# Altium schematic sheet Block_Diagram.SchDoc
size 420 x 297 mm; Date: 10.07.2023; Revision: AA; SheetNumber: 1; SheetTotal: 4
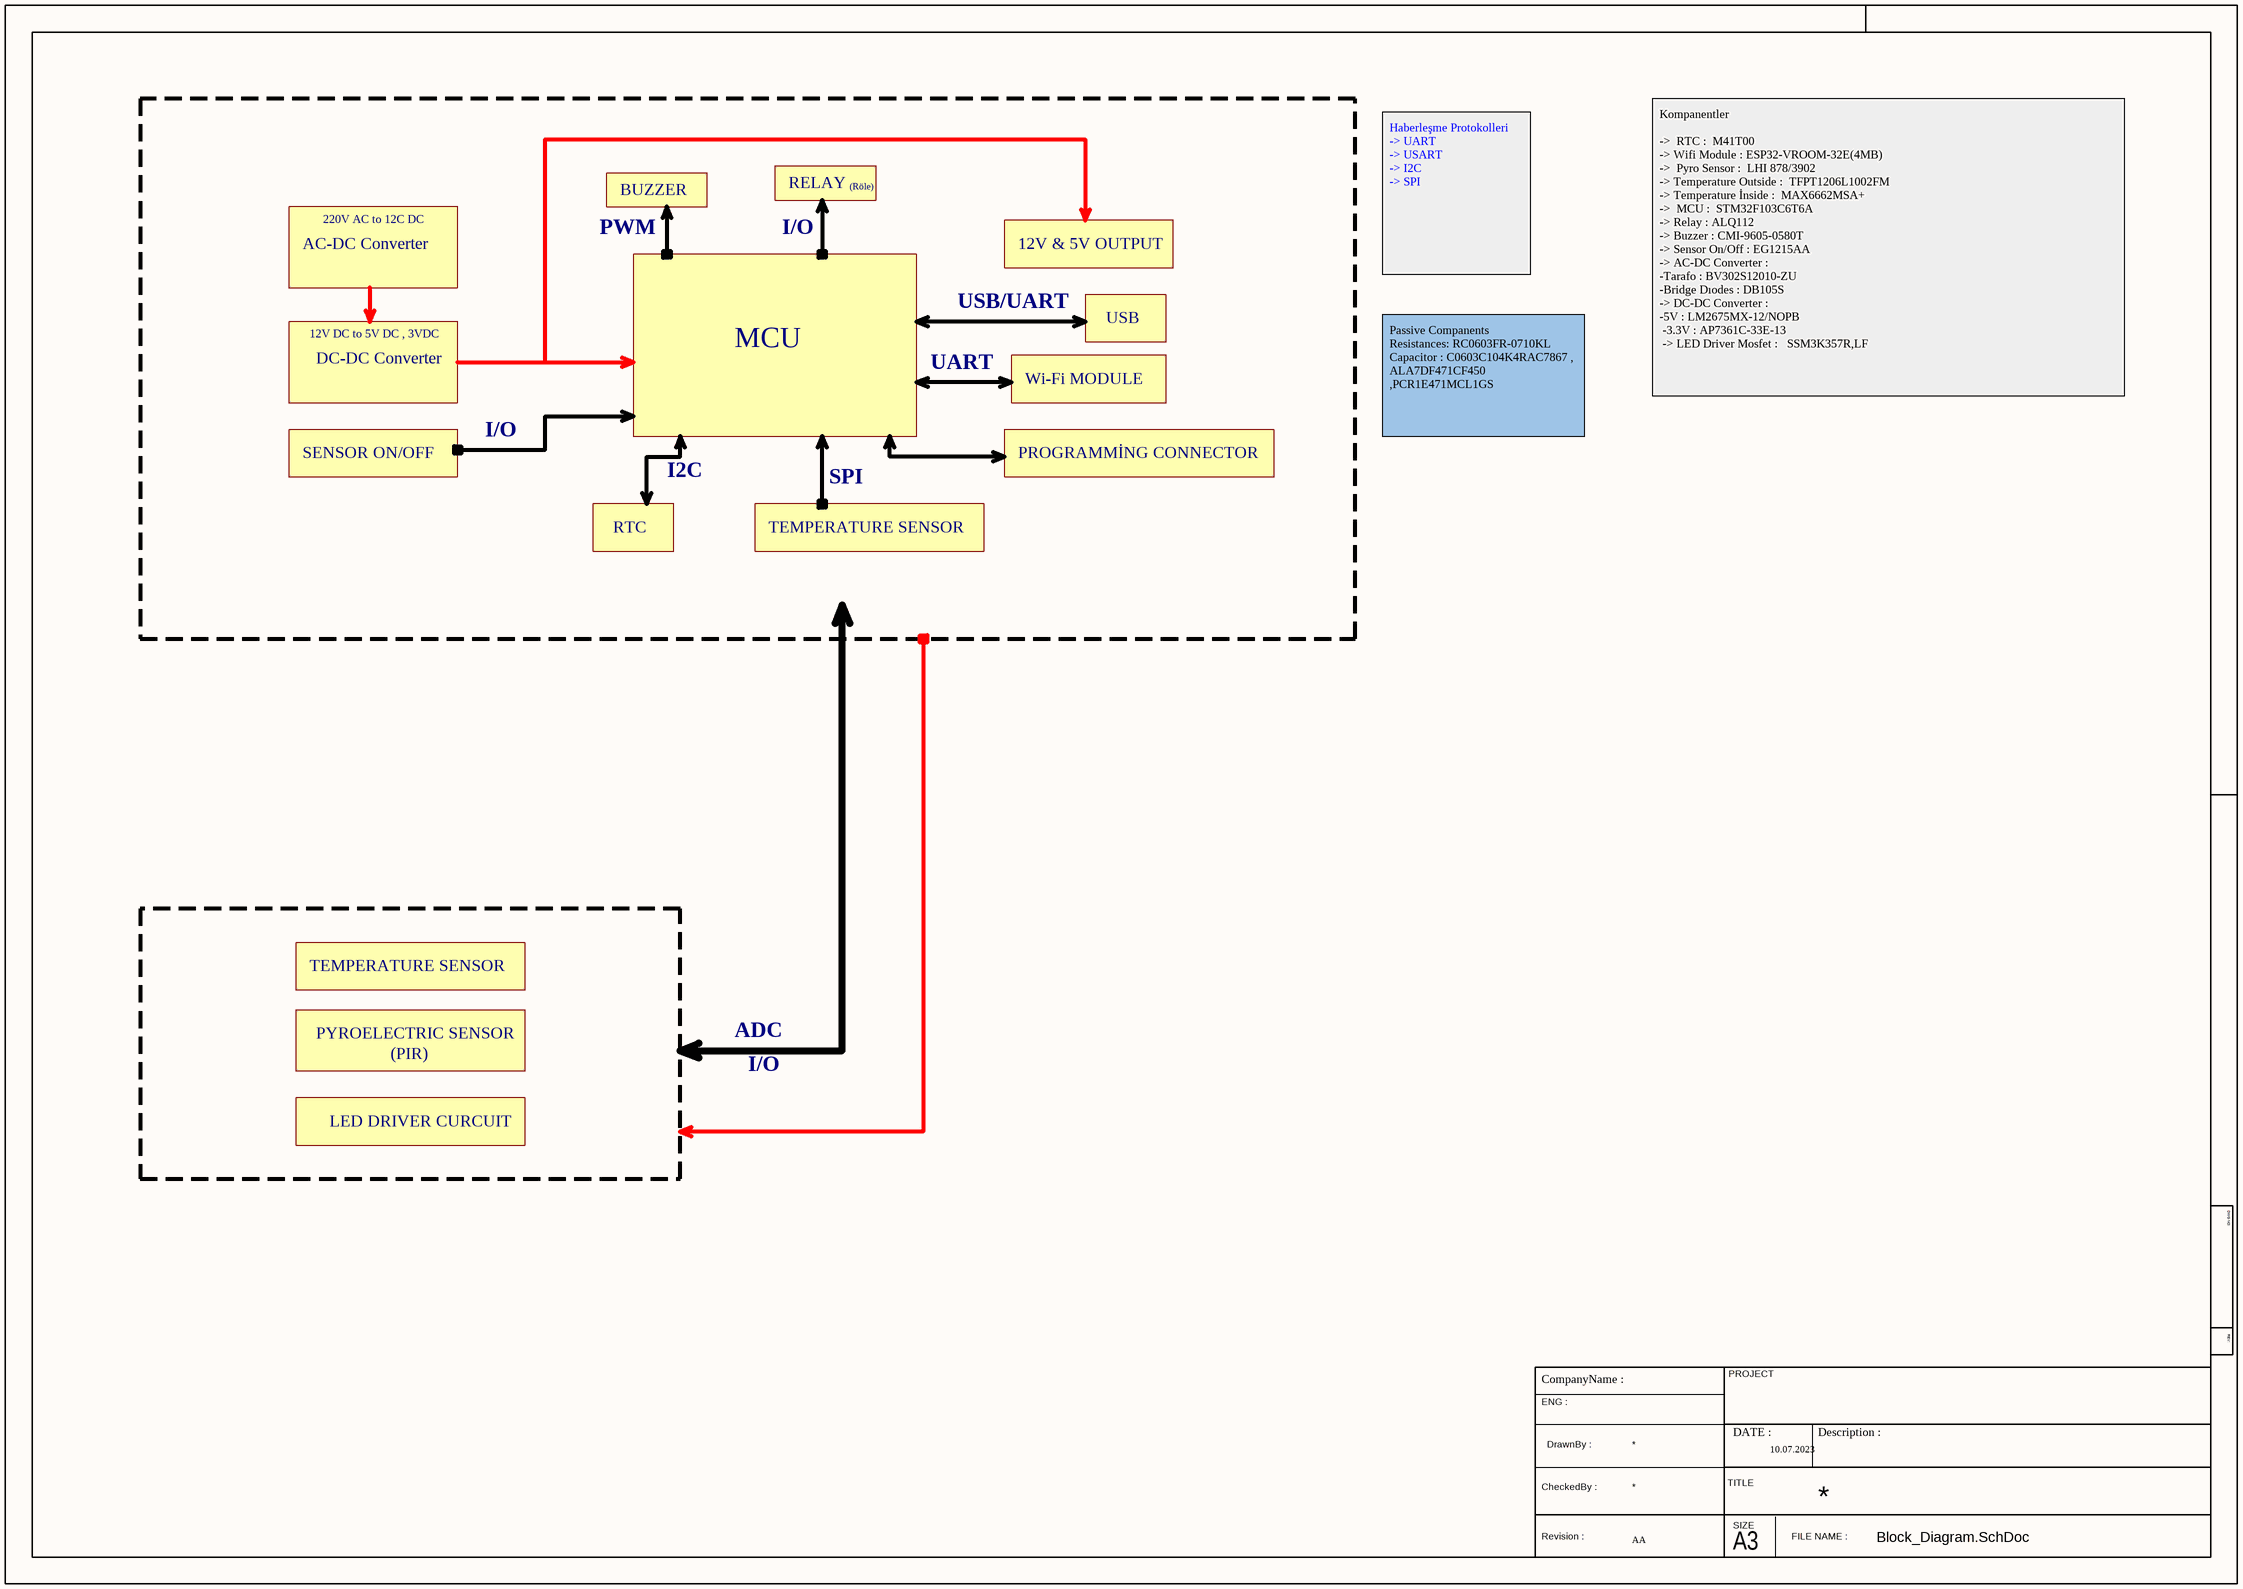
[diagram p0: Block_Diagram.SchDoc]

## Notes on the sheet
- RELAY
- (Röle)
- AC-DC Converter
- 220V AC to 12C DC
- PWM
- BUZZER
- I/O
- 12V & 5V OUTPUT
- USB/UART
- USB
- Haberleşme Protokolleri                                                       -> UART                                                                               -> USART                                                                              -> I2C                                                                                   -> SPI
- 12V DC to 5V DC , 3VDC
- DC-DC Converter
- MCU
- UART
- Wi-Fi MODULE
- Kompanentler
  ->  RTC :  M41T00
  -> Wifi Module : ESP32-VROOM-32E(4MB)
  ->  Pyro Sensor :  LHI 878/3902
  -> Temperature Outside :  TFPT1206L1002FM
  -> Temperature İnside :  MAX6662MSA+
  ->  MCU :  STM32F103C6T6A
  -> Relay : ALQ112
  -> Buzzer : CMI-9605-0580T
  -> Sensor On/Off : EG1215AA
  -> AC-DC Converter :
  -Tarafo : BV302S12010-ZU
  -Bridge Dıodes : DB105S
  -> DC-DC Converter :
  -5V : LM2675MX-12/NOPB
  -3.3V : AP7361C-33E-13
  -> LED Driver Mosfet :   SSM3K357R,LF
- SENSOR ON/OFF
- PROGRAMMİNG CONNECTOR
- Passive Companents
  Resistances: RC0603FR-0710KL
  Capacitor : C0603C104K4RAC7867 ,
  ALA7DF471CF450 ,PCR1E471MCL1GS
- RTC
- I2C
- TEMPERATURE SENSOR
- SPI
- PYROELECTRIC SENSOR
- (PIR)
- ADC
- LED DRIVER CURCUIT
- DWG NO:
- REV:
- ENG :
- CompanyName :
- PROJECT
- DrawnBy :
- DATE :
- Description :
- Revision :
- CheckedBy :
- TITLE
- SIZE
- FILE NAME :
- A3